# Altium schematic sheet ControlBoard.SchDoc
size A3; SheetNumber: 1; SheetTotal: 1
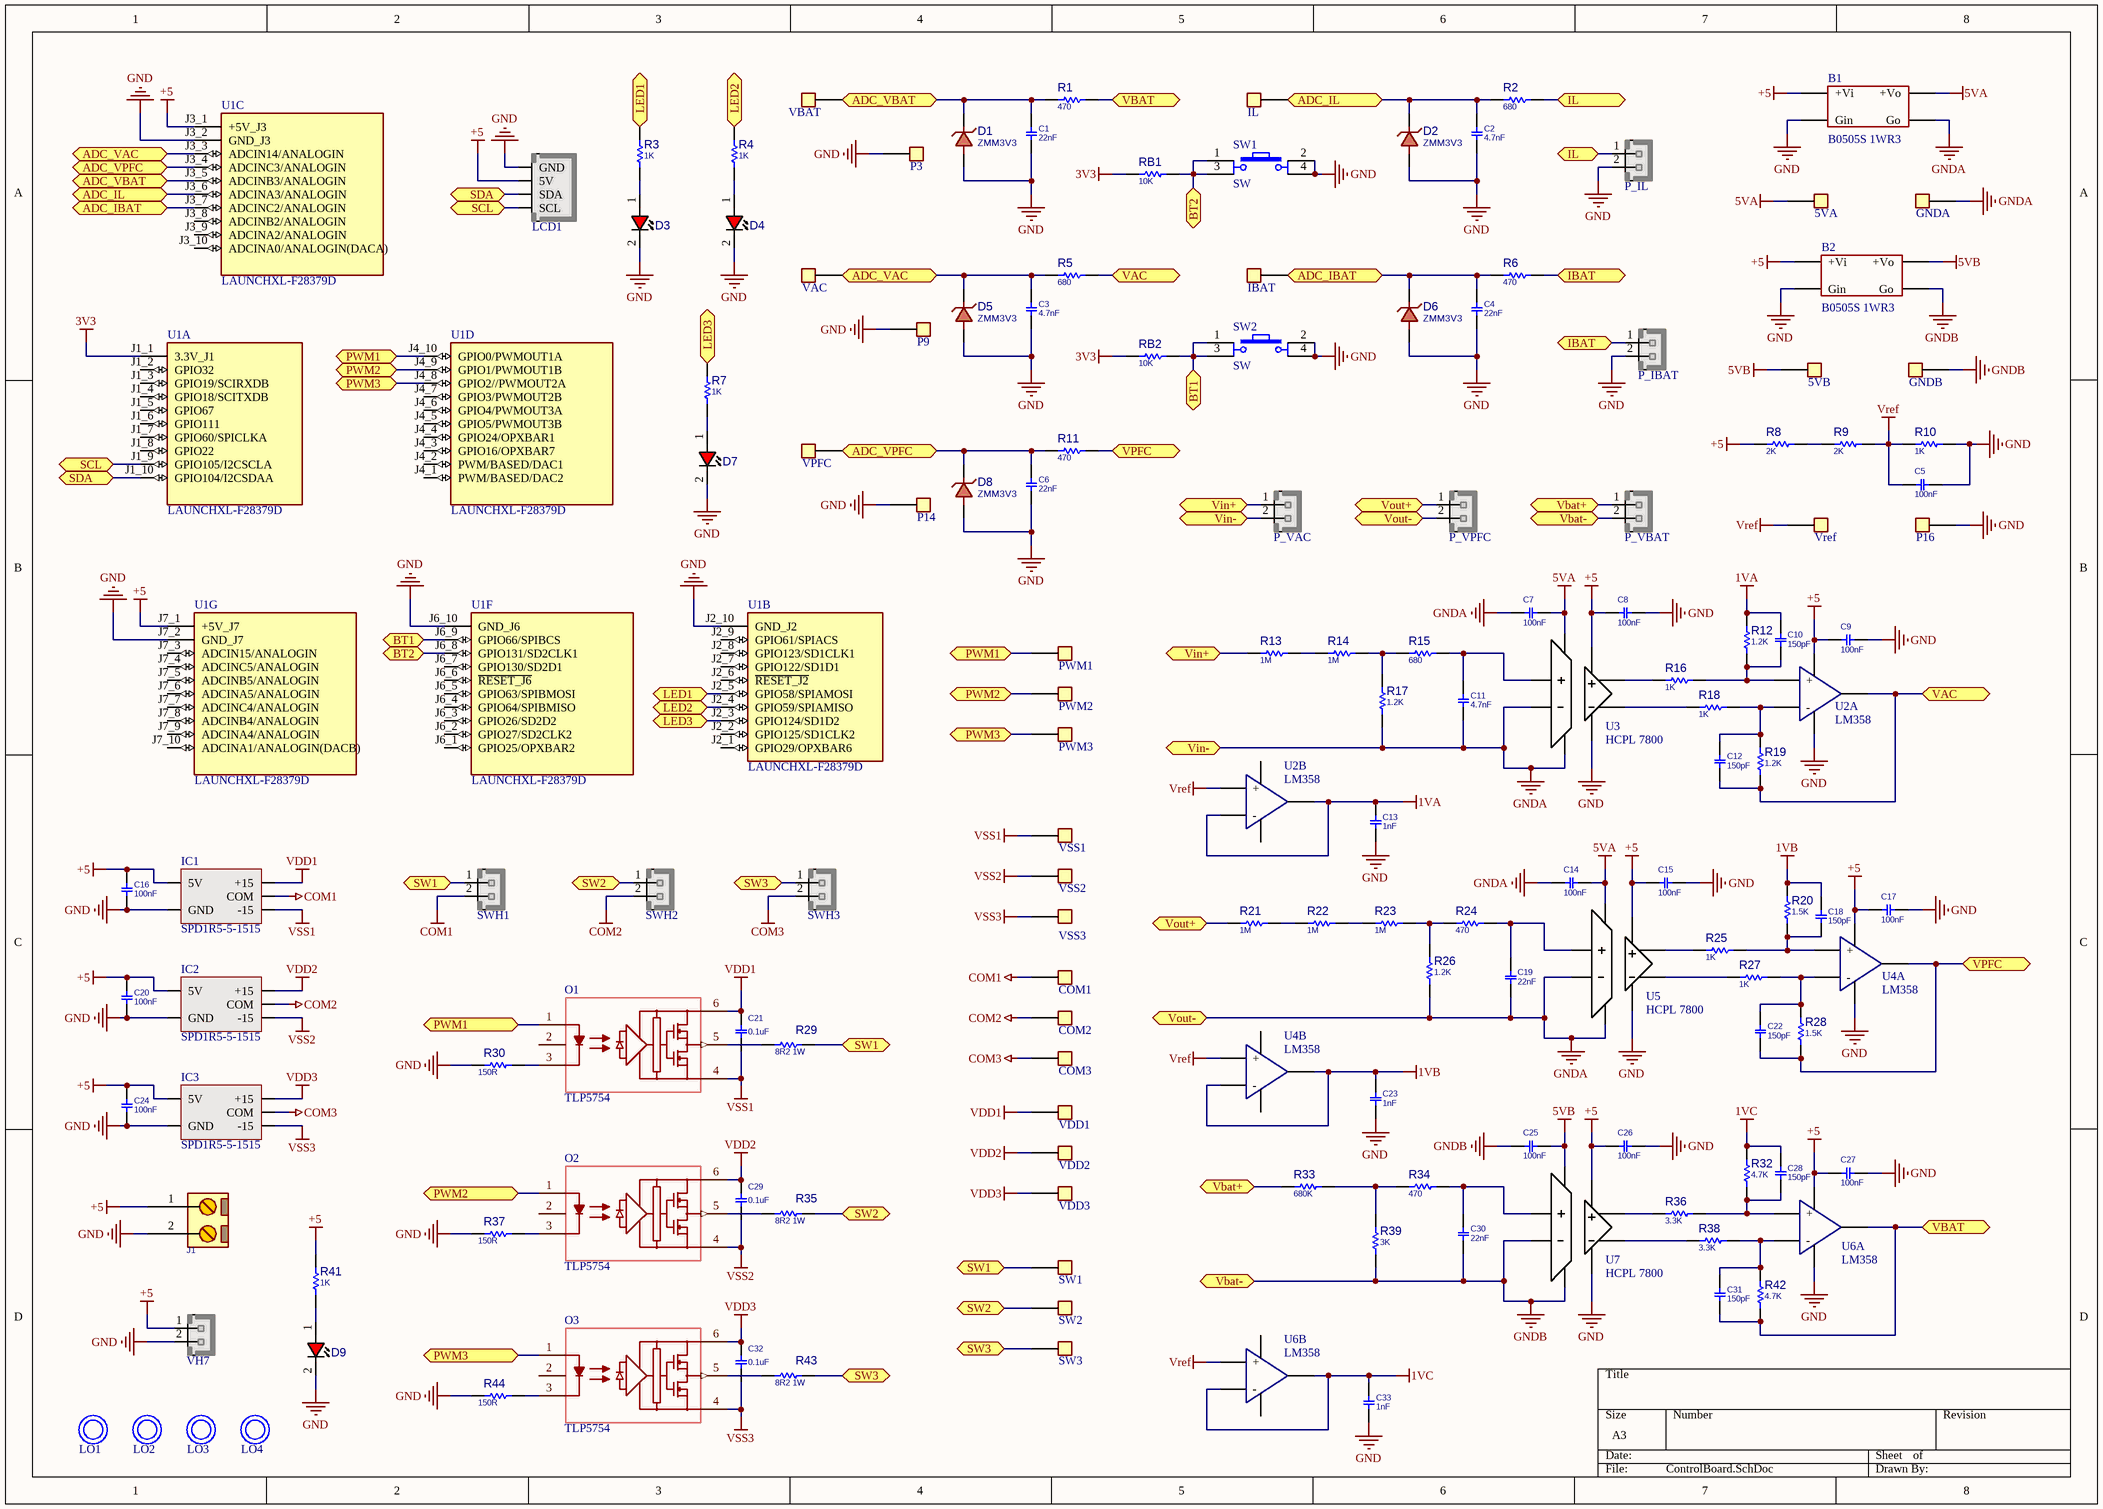
[diagram p0: ControlBoard.SchDoc]

## Parts
(Parts that share a designator on the sheet are numbered #1, #2 ... from top to bottom, then left to right.)
5VA  test PCB  [tp_red_1p]  (value not drawn)
5VB  test PCB  [tp_red_1p]  (value not drawn)
B1  B0505S 1WR3  [B0505S]
B2  B0505S 1WR3  [B0505S]
C1  22nF  [cap_0805]
C2  4.7nF  [cap_0805]
C3  4.7nF  [cap_0805]
C4  22nF  [cap_0805]
C5  100nF  [cap_0805]
C6  22nF  [cap_0805]
C7  100nF  [cap_0805]
C8  100nF  [cap_0805]
C9  100nF  [cap_0805]
C10  150pF  [cap_0805]
C11  4.7nF  [cap_0805]
C12  150pF  [cap_0805]
C13  1nF  [cap_0805]
C14  100nF  [cap_0805]
C15  100nF  [cap_0805]
C16  100nF  [cap_0805]
C17  100nF  [cap_0805]
C18  150pF  [cap_0805]
C19  22nF  [cap_0805]
C20  100nF  [cap_0805]
C21  0.1uF  [cap_0805]
C22  150pF  [cap_0805]
C23  1nF  [cap_0805]
C24  100nF  [cap_0805]
C25  100nF  [cap_0805]
C26  100nF  [cap_0805]
C27  100nF  [cap_0805]
C28  150pF  [cap_0805]
C29  0.1uF  [cap_0805]
C30  22nF  [cap_0805]
C31  150pF  [cap_0805]
C32  0.1uF  [cap_0805]
C33  1nF  [cap_0805]
COM1  test PCB  [tp_white_1p]  (value not drawn)
COM2  test PCB  [tp_white_1p]  (value not drawn)
COM3  test PCB  [tp_white_1p]  (value not drawn)
D1  ZMM3V3  [D_SOD80]
D2  ZMM3V3  [D_SOD80]
D3  (no value)  [LED0805RED]
D4  (no value)  [LED0805RED]
D5  ZMM3V3  [D_SOD80]
D6  ZMM3V3  [D_SOD80]
D7  (no value)  [LED0805RED]
D8  ZMM3V3  [D_SOD80]
D9  (no value)  [LED0805RED]
GNDA  test PCB  [Tp_black_1p]  (value not drawn)
GNDB  test PCB  [Tp_black_1p]  (value not drawn)
IBAT  test PCB  [tp_yellow_1p]  (value not drawn)
IC1  SPD1R5-5-1515  [SPS1R5]
IC2  SPD1R5-5-1515  [SPS1R5]
IC3  SPD1R5-5-1515  [SPS1R5]
IL  test PCB  [tp_yellow_1p]  (value not drawn)
J1  CONN_TB2  [TBG_2]  (value not drawn)
LCD1  HHDR_4  [XH_4]  (value not drawn)
LO1  LO KHOAN  [SCMH_M3P5FT]  (value not drawn)
LO2  LO KHOAN  [SCMH_M3P5FT]  (value not drawn)
LO3  LO KHOAN  [SCMH_M3P5FT]  (value not drawn)
LO4  LO KHOAN  [SCMH_M3P5FT]  (value not drawn)
O1  TLP5754  [TLP5754]
O2  TLP5754  [TLP5754]
O3  TLP5754  [TLP5754]
P3  test PCB  [Tp_black_1p]  (value not drawn)
P9  test PCB  [Tp_black_1p]  (value not drawn)
P14  test PCB  [Tp_black_1p]  (value not drawn)
P16  test PCB  [Tp_black_1p]  (value not drawn)
P_IBAT  HHDR_2  [XH_2]  (value not drawn)
P_IL  HHDR_2  [XH_2]  (value not drawn)
P_VAC  HHDR_2  [VH-2]  (value not drawn)
P_VBAT  HHDR_2  [VH-2]  (value not drawn)
P_VPFC  HHDR_2  [VH-2]  (value not drawn)
PWM1  test PCB  [tp_yellow_1p]  (value not drawn)
PWM2  test PCB  [tp_yellow_1p]  (value not drawn)
PWM3  test PCB  [tp_yellow_1p]  (value not drawn)
R1  470  [R0805]
R2  680  [R0805]
R3  1K  [R0805]
R4  1K  [R0805]
R5  680  [R0805]
R6  470  [R0805]
R7  1K  [R0805]
R8  2K  [R0805]
R9  2K  [R0805]
R10  1K  [R0805]
R11  470  [R0805]
R12  1.2K  [R0805]
R13  1M  [R1206]
R14  1M  [R1206]
R15  680  [R0805]
R16  1K  [R0805]
R17  1.2K  [R1206]
R18  1K  [R0805]
R19  1.2K  [R0805]
R20  1.5K  [R0805]
R21  1M  [R1206]
R22  1M  [R1206]
R23  1M  [R1206]
R24  470  [R0805]
R25  1K  [R0805]
R26  1.2K  [R1206]
R27  1K  [R0805]
R28  1.5K  [R0805]
R29  8R2 1W  [R2512]
R30  150R  [R0805]
R32  4.7K  [R0805]
R33  680K  [R0805]
R34  470  [R0805]
R35  8R2 1W  [R2512]
R36  3.3K  [R0805]
R37  150R  [R0805]
R38  3.3K  [R0805]
R39  3K  [R0805]
R41  1K  [R0805]
R42  4.7K  [R0805]
R43  8R2 1W  [R2512]
R44  150R  [R0805]
RB1  10K  [R0805]
RB2  10K  [R0805]
SW1#1  SW  [SWPBS_SPDT_6X6X5]
SW1#2  test PCB  [Tp_blue_1p]  (value not drawn)
SW2#1  SW  [SWPBS_SPDT_6X6X5]
SW2#2  test PCB  [Tp_blue_1p]  (value not drawn)
SW3  test PCB  [Tp_blue_1p]  (value not drawn)
SWH1  HHDR_2  [VH-2]  (value not drawn)
SWH2  HHDR_2  [VH-2]  (value not drawn)
SWH3  HHDR_2  [VH-2]  (value not drawn)
U1  LAUNCHXL-F28379D  [MOD_LC-F28379D]  (parts A,B,C,D,F,G of 8)
U2  LM358  [SOIC-8]  (parts A,B of 2)
U3  HCPL 7800  [SOP-8P]
U4  LM358  [SOIC-8]  (parts A,B of 2)
U5  HCPL 7800  [SOP-8P]
U6  LM358  [SOIC-8]  (parts A,B of 2)
U7  HCPL 7800  [SOP-8P]
VAC  test PCB  [tp_yellow_1p]  (value not drawn)
VBAT  test PCB  [tp_yellow_1p]  (value not drawn)
VDD1  test PCB  [tp_red_1p]  (value not drawn)
VDD2  test PCB  [tp_red_1p]  (value not drawn)
VDD3  test PCB  [tp_red_1p]  (value not drawn)
VH7  HHDR_2  [VH-2]  (value not drawn)
VPFC  test PCB  [tp_yellow_1p]  (value not drawn)
Vref  test PCB  [tp_red_1p]  (value not drawn)
VSS1  test PCB  [Tp_black_1p]  (value not drawn)
VSS2  test PCB  [Tp_black_1p]  (value not drawn)
VSS3  test PCB  [Tp_black_1p]  (value not drawn)

## Ports
ADC_IBAT (bidir), ADC_IL (bidir), ADC_VAC (bidir), ADC_VBAT (bidir), ADC_VPFC (bidir), BT1 (bidir), BT2 (bidir), IBAT (bidir), IL (bidir), LED1 (bidir), LED2 (bidir), LED3 (bidir), PWM1 (bidir), PWM2 (bidir), PWM3 (bidir), SCL (bidir), SDA (bidir), SW1 (bidir), SW2 (bidir), SW3 (bidir), VAC (bidir), VBAT (bidir), Vbat+ (bidir), Vbat- (bidir), Vin+ (bidir), Vin- (bidir), Vout+ (bidir), Vout- (bidir), VPFC (bidir)

## Nets
1VA: C10.2 C13.2 R12.2 U2.6(-) U2.7(OUT2)
1VB: C18.2 C23.2 R20.2 U4.6(-) U4.7(OUT2)
1VC: C28.2 C33.2 R32.2 U6.6(-) U6.7(OUT2)
3V3: RB1.1 RB2.1 U1.J1_1(3.3V_J1)
5VA: 5VA.1 B1.4(+Vo) C7.2 C14.2 U3.1(VDD1) U5.1(VDD1)
5VB: 5VB.1 B2.4(+Vo) C25.2 U7.1(VDD1)
+5: B1.2(+Vi) B2.2(+Vi) C8.1 C9.1 C15.1 C16.2 C17.1 C20.2 C24.2 C26.1 C27.1 IC1.1(5V) IC2.1(5V) IC3.1(5V) J1.1 LCD1.2(5V) R8.2 R41.1 U1.J3_1(+5V_J3) U1.J7_1(+5V_J7) U2.8(VCC) U3.8(VDD2) U4.8(VCC) U5.8(VDD2) U6.8(VCC) U7.8(VDD2) VH7.1
COM1: COM1.1 IC1.4(COM) SWH1.2
COM2: COM2.1 IC2.4(COM) SWH2.2
COM3: COM3.1 IC3.4(COM) SWH3.2
GND: B1.1(Gin) B2.1(Gin) C1.1 C2.1 C3.1 C4.1 C5.1 C6.1 C8.2 C9.2 C13.1 C15.2 C16.1 C17.2 C20.1 C23.1 C24.1 C26.2 C27.2 C33.1 D1.1 D2.1 D3.2(CATHODE) D4.2(CATHODE) D5.1 D6.1 D7.2(CATHODE) D8.1 D9.2(CATHODE) IC1.2(GND) IC2.2(GND) IC3.2(GND) J1.2 LCD1.1(GND) P3.1 P9.1 P14.1 P16.1 P_IBAT.2 P_IL.2 R10.1 R30.1 R37.1 R44.1 SW1#1.2 SW1#1.4 SW2#1.2 SW2#1.4 U1.J2_10(GND_J2) U1.J3_2(GND_J3) U1.J6_10(GND_J6) U1.J7_2(GND_J7) U2.4(GND) U3.5(GND2) U4.4(GND) U5.5(GND2) U6.4(GND) U7.5(GND2) VH7.2
GNDA: B1.3(Go) C7.1 C11.1 C14.1 C19.1 GNDA.1 P_VAC.2 P_VPFC.2 R17.1 R26.1 U3.3(-) U3.4(GND1) U5.3(-) U5.4(GND1) ; port Vin-, port Vout-
GNDB: B2.3(Go) C25.1 C30.1 GNDB.1 P_VBAT.2 R39.1 U7.3(-) U7.4(GND1) ; port Vbat-
VDD1: C21.2 IC1.5(+15) O1.6(VCC) VDD1.1
VDD2: C29.2 IC2.5(+15) O2.6(VCC) VDD2.1
VDD3: C32.2 IC3.5(+15) O3.6(VCC) VDD3.1
Vref: C5.2 R9.1 R10.2 U2.5(+) U4.5(+) U6.5(+) Vref.1
VSS1: C21.1 IC1.3(-15) O1.4(GND) VSS1.1
VSS2: C29.1 IC2.3(-15) O2.4(GND) VSS2.1
VSS3: C32.1 IC3.3(-15) O3.4(GND) VSS3.1
ADC_IBAT: C4.2 D6.2 IBAT.1 R6.1 U1.J3_7(ADCINC2/ANALOGIN) ; port ADC_IBAT
ADC_IL: C2.2 D2.2 IL.1 R2.1 U1.J3_6(ADCINA3/ANALOGIN) ; port ADC_IL
ADC_VAC: C3.2 D5.2 R5.1 U1.J3_3(ADCIN14/ANALOGIN) VAC.1 ; port ADC_VAC
ADC_VBAT: C1.2 D1.2 R1.1 U1.J3_5(ADCINB3/ANALOGIN) VBAT.1 ; port ADC_VBAT
ADC_VPFC: C6.2 D8.2 R11.1 U1.J3_4(ADCINC3/ANALOGIN) VPFC.1 ; port ADC_VPFC
BT1: RB2.2 SW2#1.1 SW2#1.3 U1.J6_9(GPIO66/SPIBCS) ; port BT1
BT2: RB1.2 SW1#1.1 SW1#1.3 U1.J6_8(GPIO131/SD2CLK1) ; port BT2
IBAT: P_IBAT.1 R6.2 ; port IBAT
IL: P_IL.1 R2.2 ; port IL
LED1: R3.1 U1.J2_5(GPIO58/SPIAMOSI) ; port LED1
LED2: R4.1 U1.J2_4(GPIO59/SPIAMISO) ; port LED2
LED3: R7.1 U1.J2_3(GPIO124/SD1D2) ; port LED3
PWM1: O1.1(NC) PWM1.1 U1.J4_10(GPIO0/PWMOUT1A) ; port PWM1
PWM2: O2.1(NC) PWM2.1 U1.J4_9(GPIO1/PWMOUT1B) ; port PWM2
PWM3: O3.1(NC) PWM3.1 U1.J4_8(GPIO2//PWMOUT2A) ; port PWM3
SCL: LCD1.4(SCL) U1.J1_9(GPIO105/I2CSCLA) ; port SCL
SDA: LCD1.3(SDA) U1.J1_10(GPIO104/I2CSDAA) ; port SDA
SW1: R29.2 SW1#2.1 SWH1.1 ; port SW1
SW2: R35.2 SW2#2.1 SWH2.1 ; port SW2
SW3: R43.2 SW3.1 SWH3.1 ; port SW3
VAC: C12.1 R5.2 R19.1 U2.1(OUT1) ; port VAC
VBAT: C31.1 R1.2 R42.1 U6.1(OUT1) ; port VBAT
Vbat+: P_VBAT.1 R33.1 ; port Vbat+
Vin+: P_VAC.1 R13.1 ; port Vin+
Vout+: P_VPFC.1 R21.1 ; port Vout+
VPFC: C22.1 R11.2 R28.1 U4.1(OUT1) ; port VPFC
NetC10_1: C10.1 R12.1 R16.2 U2.3(+)
NetC11_2: C11.2 R15.1 U3.2(+)
NetC12_2: C12.2 R18.2 R19.2 U2.2(-)
NetC18_1: C18.1 R20.1 R25.2 U4.3(+)
NetC19_2: C19.2 R24.1 U5.2(+)
NetC22_2: C22.2 R27.2 R28.2 U4.2(-)
NetC28_1: C28.1 R32.1 R36.2 U6.3(+)
NetC30_2: C30.2 R34.1 U7.2(+)
NetC31_2: C31.2 R38.2 R42.2 U6.2(-)
NetD3_1: D3.1(ANODE) R3.2
NetD4_1: D4.1(ANODE) R4.2
NetD7_1: D7.1(ANODE) R7.2
NetD9_1: D9.1(ANODE) R41.2
NetO1_3: O1.3(KATHODE) R30.2
NetO1_5: O1.5(VO) R29.1
NetO2_3: O2.3(KATHODE) R37.2
NetO2_5: O2.5(VO) R35.1
NetO3_3: O3.3(KATHODE) R44.2
NetO3_5: O3.5(VO) R43.1
NetR8_1: R8.1 R9.2
NetR13_2: R13.2 R14.1
NetR14_2: R14.2 R15.2 R17.2
NetR16_1: R16.1 U3.7(+)
NetR18_1: R18.1 U3.6(-)
NetR21_2: R21.2 R22.1
NetR22_2: R22.2 R23.1
NetR23_2: R23.2 R24.2 R26.2
NetR25_1: R25.1 U5.7(+)
NetR27_1: R27.1 U5.6(-)
NetR33_2: R33.2 R34.2 R39.2
NetR36_1: R36.1 U7.7(+)
NetR38_1: R38.1 U7.6(-)

Not connected (* = marked no-connect by the designer): O1 2(ANODE); O2 2(ANODE); O3 2(ANODE); U1 J1_2(GPIO32) J1_3(GPIO19/SCIRXDB) J1_4(GPIO18/SCITXDB) J1_5(GPIO67) J1_6(GPIO111) J1_7(GPIO60/SPICLKA) J1_8(GPIO22) J2_1(GPIO29/OPXBAR6) J2_2(GPIO125/SD1CLK2) J2_6(~{RESET_J2}) J2_7(GPIO122/SD1D1) J2_8(GPIO123/SD1CLK1) J2_9(GPIO61/SPIACS) J3_8(ADCINB2/ANALOGIN) J3_9(ADCINA2/ANALOGIN) J3_10(ADCINA0/ANALOGIN(DACA)) J4_1(PWM/BASED/DAC2) J4_2(PWM/BASED/DAC1) J4_3(GPIO16/OPXBAR7) J4_4(GPIO24/OPXBAR1) J4_5(GPIO5/PWMOUT3B) J4_6(GPIO4/PWMOUT3A) J4_7(GPIO3/PWMOUT2B) J6_1(GPIO25/OPXBAR2) J6_2(GPIO27/SD2CLK2) J6_3(GPIO26/SD2D2) J6_4(GPIO64/SPIBMISO) J6_5(GPIO63/SPIBMOSI) J6_6(~{RESET_J6}) J6_7(GPIO130/SD2D1) J7_3(ADCIN15/ANALOGIN) J7_4(ADCINC5/ANALOGIN) J7_5(ADCINB5/ANALOGIN) J7_6(ADCINA5/ANALOGIN) J7_7(ADCINC4/ANALOGIN) J7_8(ADCINB4/ANALOGIN) J7_9(ADCINA4/ANALOGIN) J7_10(ADCINA1/ANALOGIN(DACB))

## Library data of the parts
5VA 5VB COM1-COM3 GNDA GNDB IBAT IL P3 P9 P14 P16 PWM1-PWM3 SW1#2 SW2#2 SW3 VAC VBAT VDD1-VDD3 VPFC Vref VSS1-VSS3 = test PCB: testpin
B1 B2 = B0505S 1WR3: B0505S 1WR3 Isolated Module DC DC Converter
C1-C33 = CAP SMD: PARAM: -, -%; MANF_P#: MANF_PART#; PARAM2: -V; PRICE: 100= 1$; MANF: -; ASSEMBLY: ASSEMBLY
  C1 C4 C6 C19 C30: VALUE: 22nF
  C2 C3 C11: VALUE: 4.7nF
  C5 C7-C9 C14-C17 C20 C24-C27: VALUE: 100nF
  C10 C12 C18 C22 C28 C31: VALUE: 150pF
  C13 C23 C33: VALUE: 1nF
  C21 C29 C32: VALUE: 0.1uF
D1 D2 D5 D6 D8 = DIODE Zener: DESC: DESCRIPTION; PARAM: 75V; PARAM2: 0.3A; MANF_P#: 1N4148; MANF: MANF; ASSEMBLY: ASSEMBLY; PRICE: PRICE; Parameter 1: *; VALUE: ZMM3V3
D3 D4 D7 D9 = LED_SMD_0805_RED: LED, SMD, 0805, RED; DESC: DESCRIPTION; MANF_P#: MANF_PART#; PARAM2: 2.2V; MANF: MANF; ASSEMBLY: ASSEMBLY; PRICE: 36t@Javan
IC1-IC3 = SPD1R5-5-1515: Power supply Driver SPD1R5-5-1515 / Efficiency 80% / Input 0.381A / Output 50mA
J1 = CONN_TB2: CONN, TERMINAL BLOCK, 5.08mm pitch; VALUE: CONN_TB2
LCD1 = LCD I2C: LCD I2C JST-XH pitch: 2.5mm; VALUE: HHDR_4
O1-O3 = TLP5754: MF: Toshiba Semiconductor; MP: TLP250; Purchase-URL: https://pricing.snapeda.com/search/part/TLP250/?ref=eda; SnapEDA_Link: https://www.snapeda.com/parts/TLP250/Toshiba+Semiconductor+and+Storage/view-part/?ref=snap; Value: *; Package: DIP-8 Toshiba; Availability: In Stock; Price: None; Check_prices: https://www.snapeda.com/parts/TLP250/Toshiba+Semiconductor+and+Storage/view-part/?ref=eda
P_IBAT P_IL = XH_2: XH 2 JST-XH pitch: 2.5mm; VALUE: HHDR_2
P_VAC P_VBAT P_VPFC SWH1-SWH3 VH7 = VH-2: VALUE: HHDR_2
R1-R30 R32-R39 R41-R44 RB1 RB2 = RES SMD: MANF_P#: WSLP0805R0100FEA; MANF: VISHAY; PARAM: 0.5W, -55~155oC; DESC: DESCRIPTION; DIST#: MOUSER; PARAM2: 1%; ASSEMBLY: ASSEMBLY; PRICE: 0.5$
  R1 R6 R11 R24 R34: VALUE: 470
  R2 R5 R15: VALUE: 680
  R3 R4 R7 R10 R16 R18 R25 R27 R41: VALUE: 1K
  R8 R9: VALUE: 2K
  R12 R17 R19 R26: VALUE: 1.2K
  R13 R14 R21-R23: VALUE: 1M
  R20 R28: VALUE: 1.5K
  R29 R35 R43: VALUE: 8R2 1W
  R30 R37 R44: VALUE: 150R
  R32 R42: VALUE: 4.7K
  R33: VALUE: 680K
  R36 R38: VALUE: 3.3K
  R39: VALUE: 3K
  RB1 RB2: VALUE: 10K
SW1#1 SW2#1 = SW4: Switch button 4 pin; Value: Button chip 4 pin
U2 U4 U6 = LM358: LM358 Dual Opamp
U3 U5 U7 = HCPL 7800: HCPL 7800 Isolation Amplifer, Opamp
U1 = LAUNCHXL-F28379D: Price: None; Value: *; Package: None; Availability: Unavailable; MP: LAUNCHXL-F28379D